# EAGLE design PCB 2d (EAGLE 9.0.1)
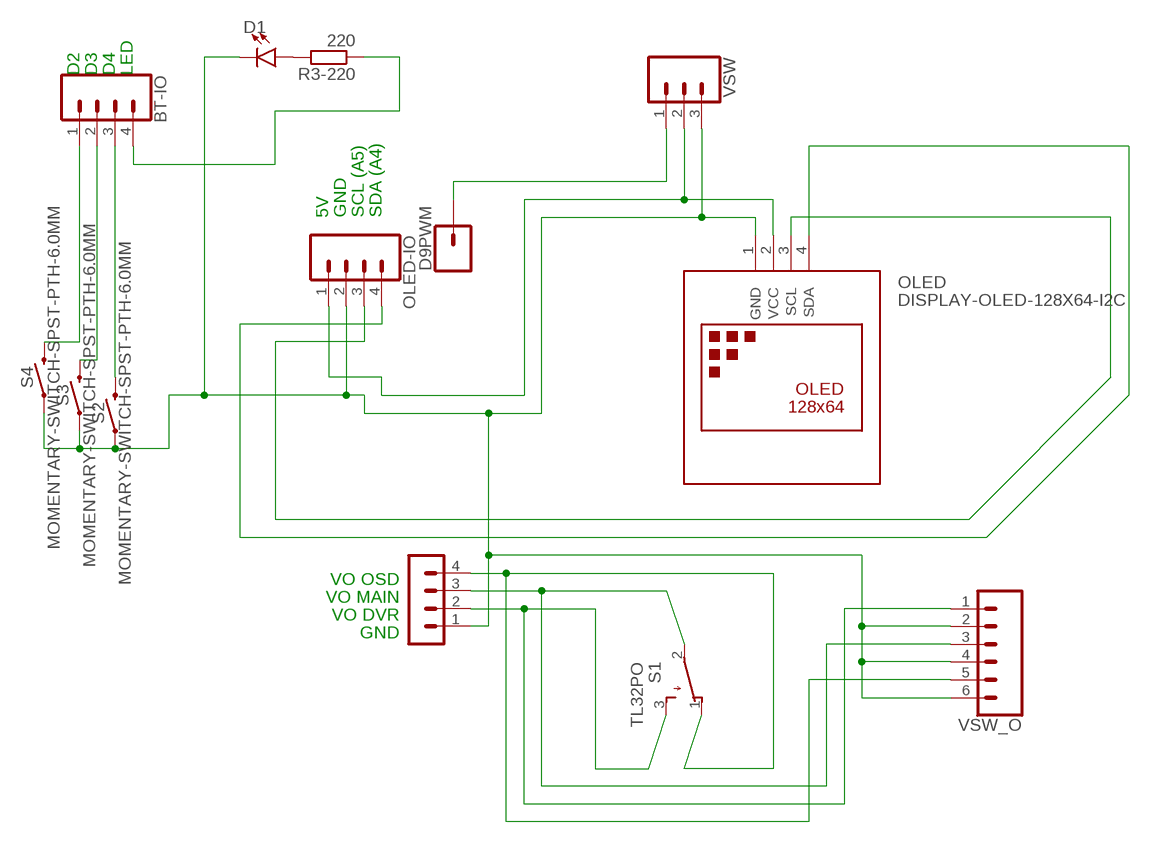
[diagram p0: schematic, sheet 1]

## Parts
BT-IO  CONN_04  [1X04]
D1  LED3MM  [LED_3MM]
D9PWM  CONN_01  [1X01]
IO3  MA04-1  [MA04-1]
OLED  DISPLAY-OLED-128X64-I2C  [DISPLAY-OLED-128X64-I2C]
OLED-IO  CONN_04  [1X04]
R3-220  220  R-EU_R1206  [R1206]
S1  TL32PO  [TL3XPO]
S2  MOMENTARY-SWITCH-SPST-PTH-6.0MM  [TACTILE_SWITCH_PTH_6.0MM]
S3  MOMENTARY-SWITCH-SPST-PTH-6.0MM  [TACTILE_SWITCH_PTH_6.0MM]
S4  MOMENTARY-SWITCH-SPST-PTH-6.0MM  [TACTILE_SWITCH_PTH_6.0MM]
VSW  CONN_03  [1X03]
VSW_O  CONN_06SILK_FEMALE_PTH  [1X06]

## Nets
GND: D1.K(C) IO3.1 OLED-IO.2 OLED.1(GND) S2.1 S3.1 S4.1 VSW.3 VSW_O.2 VSW_O.4 VSW_O.6
N$1: D1.A R3-220.2
N$2 [thin]: BT-IO.1 S4.3
N$3 [medium]: IO3.3 S1.2(P) VSW_O.3
N$4: OLED-IO.1 OLED.2(VCC) VSW.2
N$5: BT-IO.4 R3-220.1
N$6 [thin]: OLED-IO.4 OLED.4(SDA)
N$7 [thin]: OLED-IO.3 OLED.3(SCL)
N$8: D9PWM.1 VSW.1
N$10 [medium]: IO3.2 S1.3(S) VSW_O.1
N$11 [thin]: BT-IO.2 S3.3
N$12 [thin]: BT-IO.3 S2.3
VIDOUT [medium]: IO3.4 S1.1(O) VSW_O.5

## Notes on the sheet
- D2 | D3 | D4 | LED
- 5V | GND | SCL (A5) | SDA (A4)
- VO OSD
- VO MAIN
- VO DVR
- GND

## Library data of the parts
BT-IO OLED-IO = SparkFun-Connectors:CONN_04: Multi connection point. Often used as Generic Header-pin footprint for 0.1 inch spaced/style header connections On any of the 0.1 inch spaced packages, you can populate with these: Break Away Headers - Straight <https://www.sparkfun.com/products/116> (PRT-00116) Break Away Male Headers - Right Angle <https://www.sparkfun.com/products/553> (PRT-00553) Female Headers <https://www.sparkfun.com/products/115> (PRT-00115) Break Away Headers - Machine Pin <https://www.sparkfun.com/products/117> (PRT-00117) Break Away Female Headers - Swiss Machine Pin <https://www.sparkfun.com/products/743> (PRT-00743) For SCREWTERMINALS and SPRING TERMINALS visit here: Screw Terimnals on SparkFun.com <https://www.sparkfun.com/search/results?term=Screw+Terminals> (5mm/3.5mm/2.54mm spacing) This device is also useful as a general connection point to wire up your design to another part of your project. Our various solder wires solder well into these plated through hole pads. Hook-Up Wire - Assortment (Stranded, 22 AWG) <https://www.sparkfun.com/products/11375> (PRT-11375) Hook-Up Wire - Assortment (Solid Core, 22 AWG) <https://www.sparkfun.com/products/11367> (PRT-11367) View the entire wire category on our website here <https://www.sparkfun.com/categories/141> Special notes: Molex polarized connector foot print use with SKU : PRT-08231 with associated crimp pins and housings. 1MM SMD Version SKU: PRT-10208; PROD_ID: CONN-09696
D1 = SparkFun-LED:LED: LED (Generic) Standard schematic elements and footprints for 5mm, 3mm, 1206, and 0603 sized LEDs. Generic LEDs with no color specified.; PROD_ID: DIO-08794
D9PWM = SparkFun-Connectors:CONN_01: Single connection point. Often used as Generic Header-pin footprint for 0.1 inch spaced/style header connections On any of the 0.1 inch spaced packages, you can populate with these: Break Away Headers - Straight <https://www.sparkfun.com/products/116> (PRT-00116) Break Away Male Headers - Right Angle <https://www.sparkfun.com/products/553> (PRT-00553) Female Headers <https://www.sparkfun.com/products/115> (PRT-00115) Break Away Headers - Machine Pin <https://www.sparkfun.com/products/117> (PRT-00117) Break Away Female Headers - Swiss Machine Pin <https://www.sparkfun.com/products/743> (PRT-00743) This device is also useful as a general connection point to wire up your design to another part of your project. Our various solder wires solder well into these plated through hole pads. Hook-Up Wire - Assortment (Stranded, 22 AWG) <https://www.sparkfun.com/products/11375> (PRT-11375) Hook-Up Wire - Assortment (Solid Core, 22 AWG) <https://www.sparkfun.com/products/11367> (PRT-11367) View the entire wire category on our website here <https://www.sparkfun.com/categories/141> Special notes: SMTSO-256-ET is a "flush mount" nut for a 4-40 screw. We mostly use this on specialty testbeds; it is a nice way to connect hardware to your PCB at an adjustable hieght. Also note, the SNAP packages are for using a snappable style connector. We sell a baggie of snaps and they are also used on two LilyPad designs: Snap Assortment - 30 pack (male and female) <https://www.sparkfun.com/products/11347> (DEV-11347) LilyPad Arduino SimpleSnap <https://www.sparkfun.com/products/10941> (DEV-10941) LilyPad SimpleSnap Protoboard <https://www.sparkfun.com/products/10940> (DEV-10940)
IO3 = con-lstb:MA04-1: PIN HEADER; OC_FARNELL: unknown; OC_NEWARK: unknown
OLED = diy-modules:DISPLAY-OLED-128X64-I2C: 128x64 Dot Matrix OLED Module based on SSD1306 chip Variant with I2C interface More details available here: http://www.instructables.com/id/Monochrome-096-i2c-OLED-display-with-arduino-SSD13/ SSD1306 datasheet: https://cdn-shop.adafruit.com/datasheets/SSD1306.pdf Click here to find device on ebay.com <http://www.ebay.com/sch/oled+display+128x64+iic> Note: There are two variants: I2C and SPI. Search for the proper version.
R3-220 = resistor:R-EU_: RESISTOR, European symbol
S1 = switch:TL32PO: TINY SWITCH ON - MOM Source: http://www2.produktinfo.conrad.com/datenblaetter/700000-724999/705152-da-01-de-Subminiaturschalter_TL_36YO.pdf
S2-S4 = SparkFun-Switches:MOMENTARY-SWITCH-SPST: Momentary Switch (Pushbutton) - SPST Normally-open (NO) SPST momentary switches (buttons, pushbuttons). Variants PTH-12MM - 12mm square, through-hole Momentary Pushbutton Switch - 12mm Square <https://www.sparkfun.com/products/9190> (COM-09190) PTH-6.0MM, PTH-6.0MM-KIT - 6.0mm square, through-hole Mini Pushbutton Switch <https://www.sparkfun.com/products/97> (COM-00097) KIT package intended for soldering kit's - only one side of pads' copper is exposed. PTH-RIGHT-ANGLE-KIT - Right-angle, through-hole Right Angle Tactile Button <https://www.sparkfun.com/products/10791> - Used on SparkFun BigTime Watch Kit <https://www.sparkfun.com/products/11734> SMD-12MM - 12mm square, surface-mount Tactile Button - SMD (12mm) <https://www.sparkfun.com/products/12993> (COM-12993) Used on SparkFun PicoBoard <https://www.sparkfun.com/products/11888> SMD-4.5MM - 4.5mm Square Trackball Switch Used on SparkFun Blackberry Trackballer Breakout <https://www.sparkfun.com/products/13169> SMD-4.6MMX2.8MM - 4.60mm x 2.80mm, surface mount Used on SparkFun SAMD21 Mini Breakout <https://www.sparkfun.com/products/13664> SMD-5.2MM, SMD-5.2-REDUNDANT - 5.2mm square, surface-mount Mini Pushbutton Switch - SMD <https://www.sparkfun.com/products/8720> (COM-08720) Used on Arduino Pro Mini <https://www.sparkfun.com/products/11114> REDUNDANT package connects both switch circuits together SMD-6.0X3.5MM - 6.0 x 3.5mm, surface mount Momentary Reset Switch SMD <https://www.sparkfun.com/products/8229> (COM-08229) SMD-6.2MM-TALL - 6.2mm square, surface mount Tactile Button - SMD (6mm) <https://www.sparkfun.com/products/12992> Used on SparkFun Digital Sandbox <https://www.sparkfun.com/products/12651> SMD-RIGHT-ANGLE - Right-angle, surface mount Used on SparkFun Block for Intel® Edison - Arduino <https://www.sparkfun.com/products/13036>; PROD_ID: SWCH-08441; SF_SKU: COM-00097
VSW = SparkFun-Connectors:CONN_03: Multi connection point. Often used as Generic Header-pin footprint for 0.1 inch spaced/style header connections On any of the 0.1 inch spaced packages, you can populate with these: Break Away Headers - Straight <https://www.sparkfun.com/products/116> (PRT-00116) Break Away Male Headers - Right Angle <https://www.sparkfun.com/products/553> (PRT-00553) Female Headers <https://www.sparkfun.com/products/115> (PRT-00115) Break Away Headers - Machine Pin <https://www.sparkfun.com/products/117> (PRT-00117) Break Away Female Headers - Swiss Machine Pin <https://www.sparkfun.com/products/743> (PRT-00743) Stackable Header - 3 Pin (Female, 0.1") <https://www.sparkfun.com/products/13875> (PRT-13875) For SCREWTERMINALS and SPRING TERMINALS visit here: Screw Terimnals on SparkFun.com <https://www.sparkfun.com/search/results?term=Screw+Terminals> (5mm/3.5mm/2.54mm spacing) This device is also useful as a general connection point to wire up your design to another part of your project. Our various solder wires solder well into these plated through hole pads. Hook-Up Wire - Assortment (Stranded, 22 AWG) <https://www.sparkfun.com/products/11375> (PRT-11375) Hook-Up Wire - Assortment (Solid Core, 22 AWG) <https://www.sparkfun.com/products/11367> (PRT-11367) View the entire wire category on our website here <https://www.sparkfun.com/categories/141> Special notes: Molex polarized connector foot print use with SKU : PRT-08232 with associated crimp pins and housings.
VSW_O = SparkFun-Connectors:CONN_06: Multi connection point. Often used as Generic Header-pin footprint for 0.1 inch spaced/style header connections On any of the 0.1 inch spaced packages, you can populate with these: Break Away Headers - Straight <https://www.sparkfun.com/products/116> (PRT-00116) Break Away Male Headers - Right Angle <https://www.sparkfun.com/products/553> (PRT-00553) Female Headers <https://www.sparkfun.com/products/115> (PRT-00115) Break Away Headers - Machine Pin <https://www.sparkfun.com/products/117> (PRT-00117) Break Away Female Headers - Swiss Machine Pin <https://www.sparkfun.com/products/743> (PRT-00743) Arduino Stackable Header - 6 Pin <https://www.sparkfun.com/products/9280> (PRT-09280) For SCREWTERMINALS and SPRING TERMINALS visit here: Screw Terimnals on SparkFun.com <https://www.sparkfun.com/search/results?term=Screw+Terminals> (5mm/3.5mm/2.54mm spacing) This device is also useful as a general connection point to wire up your design to another part of your project. Our various solder wires solder well into these plated through hole pads. Hook-Up Wire - Assortment (Stranded, 22 AWG) <https://www.sparkfun.com/products/11375> (PRT-11375) Hook-Up Wire - Assortment (Solid Core, 22 AWG) <https://www.sparkfun.com/products/11367> (PRT-11367) View the entire wire category on our website here <https://www.sparkfun.com/categories/141>; PROD_ID: CONN-08437

## Net classes
0 default: width 0.762 mm, drill 0.508 mm, clearance 0.508 mm
1 thin: width 0.3 mm, drill 0.3 mm, clearance 0.3 mm
2 medium: width 0.4 mm, drill 0.4 mm, clearance 0.4 mm

## Board
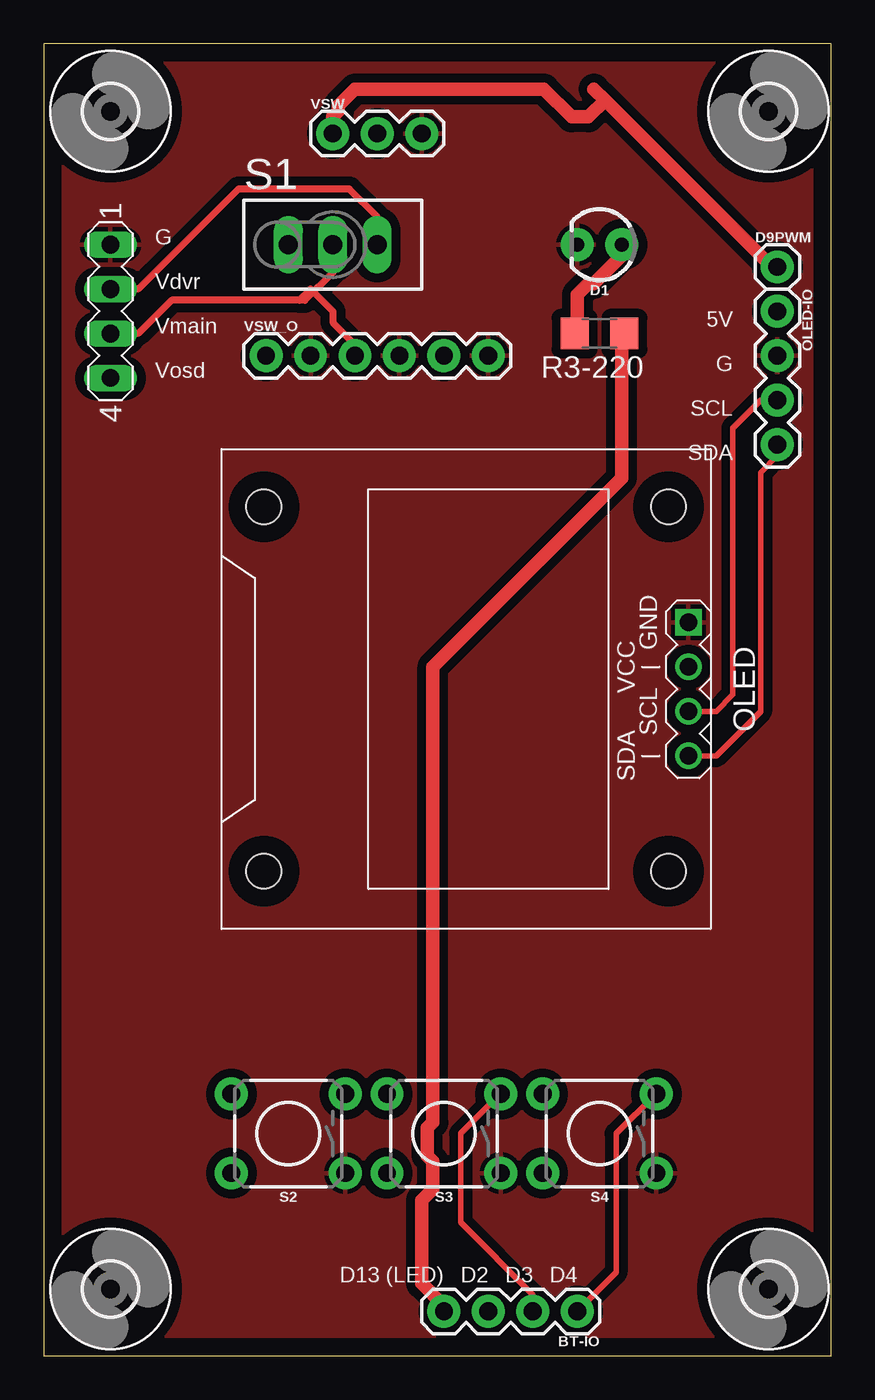
[diagram p1: board, top side]
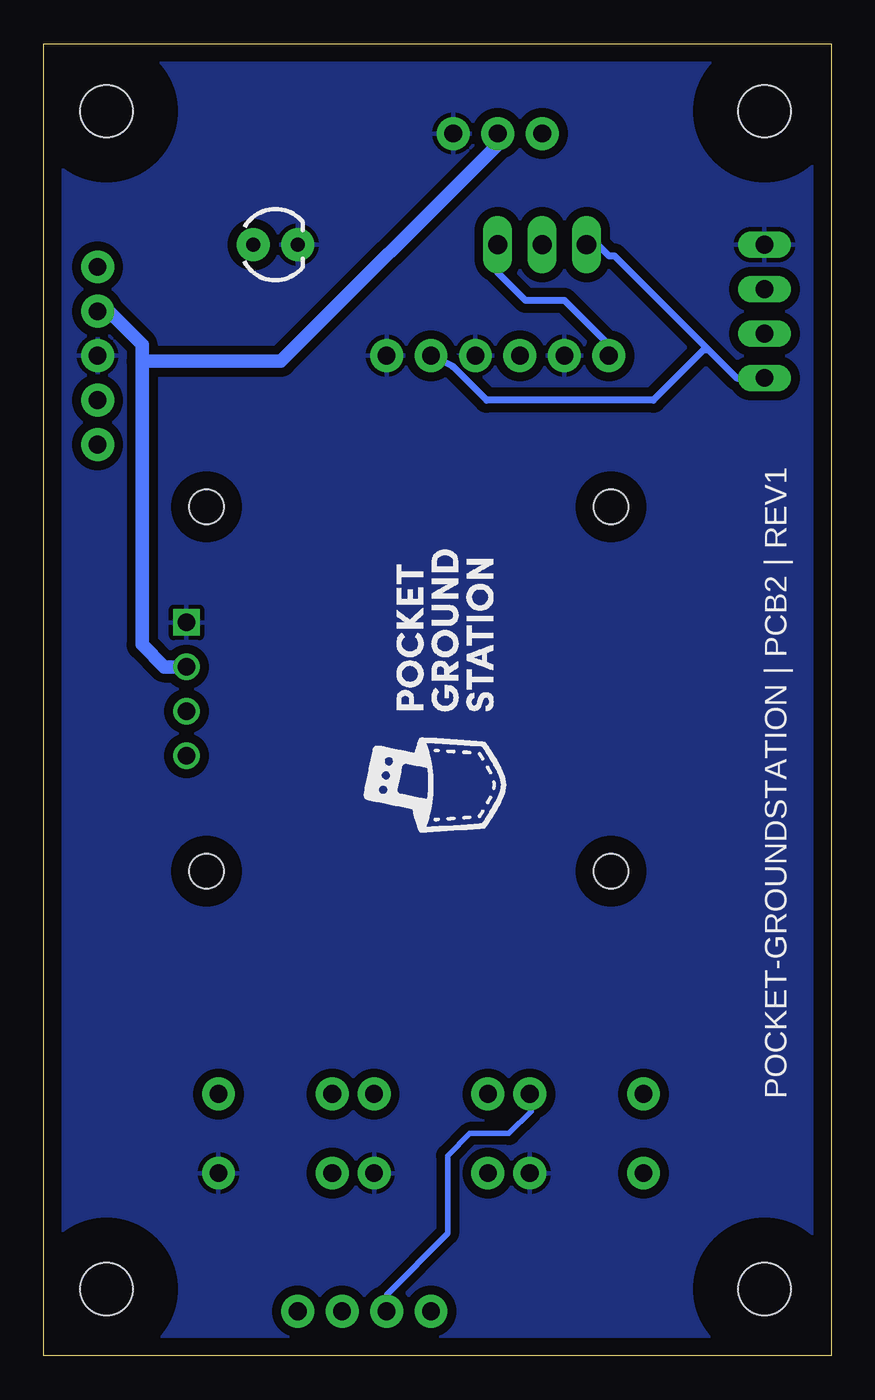
[diagram p2: board, bottom side, seen from below]

Size 44.98 x 74.98 mm. Coordinates in mm from the lower left corner, seen from the top.
Outline: 0,74.98 0,0 44.98,0 44.98,74.98 0,74.98
Copper layers (1*16): Top 0.035mm / dielectric 1.5mm / Bottom 0.035mm
Design rules "PCB Albert *": minimum track width 0.15mm, minimum drill 0.35mm, track to track 0.205mm, track to pad 0.205mm, pad to pad 0.205mm, via to via 0.205mm, smd to smd 6mil, copper to edge 40mil, drill to drill 6mil, minimum pad ring 10mil, minimum via ring 8mil, stop-mask expansion 4mil, vias tented up to drill 0mil, thermal gap 10mil

### Footprints (pad centres in the part's own frame; a part is rotated, then mirrored left to right if it is on the bottom)
1X04 = drill 1.016 pad 1.88: 1 0,0; 2 2.54,0; 3 5.08,0; 4 7.62,0
LED_3MM = drill 0.813 pad 1.88: A -1.27,0; K 1.27,0
1X01 = drill 1.016 pad 1.88: 1 0,0
MA04-1 = drill 1.016 long: 1 -3.81,0; 2 -1.27,0; 3 1.27,0; 4 3.81,0
DISPLAY-OLED-128X64-I2C = drill 1 square: 1 -3.81,12.7 | drill 1: 2 -1.27,12.7; 3 1.27,12.7; 4 3.81,12.7 | hole 2: -10.414,11.557; 10.414,11.557; 10.414,-11.557; -10.414,-11.557
R1206 = smd 1.6 x 1.803: 1 -1.422,0; 2 1.422,0
TL3XPO = drill 1.1 pad 1.422 long: 1 -2.54,0; 2 0,0; 3 2.54,0
TACTILE_SWITCH_PTH_6.0MM = drill 1.016 pad 1.88: 1 -3.251,2.261; 2 3.251,2.261; 3 -3.251,-2.261; 4 3.251,-2.261
3,0 = hole 3: 0,0
1X03 = drill 1.016 pad 1.88: 1 0,0; 2 2.54,0; 3 5.08,0
1X06 = drill 1.016 pad 1.88: 1 0,0; 2 2.54,0; 3 5.08,0; 4 7.62,0; 5 10.16,0; 6 12.7,0

### Placement (x,y rotation side)
BT-IO  30.48,2.54 180 top
D1  31.75,63.5 180 top
D9PWM  41.91,62.23 0 top
IO3  3.81,59.69 270 top
OLED  24.13,38.1 270 top
OLED-IO  41.91,59.69 270 top
R3-220  31.75,58.42 180 top
S1  16.51,63.5 0 top
S2  13.97,12.7 180 top
S3  22.86,12.7 180 top
S4  31.75,12.7 180 top
U$2  [3,0]  41.4,3.81 180 top
U$3  [3,0]  3.81,3.81 180 top
U$4  [3,0]  41.4,71.12 180 top
U$5  [3,0]  3.81,71.12 180 top
VSW  16.51,69.85 0 top
VSW_O  12.7,57.15 0 top

### Tracks (layer width: path | path; a pad name or v marks a point on that pad's centre or on a via)
GND
  pour Top: 0,74.93 0,-1.27 45.72,-1.27 45.72,76.2 0,76.2
  pour Bottom: -1.27,76.2 46.99,76.2 46.99,-2.54 -1.27,-2.54
N$1
  Top 0.762: D1.A 33.02,62.87 31.43,61.28 31.11,61.28 30.48,60.64 30.48,58.42 R3-220.2
N$2
  Top 0.3: BT-IO.1 32.7,4.76 32.7,12.7 34.92,14.92 S4.3
N$3
  Top 0.4: IO3.3 5.4,58.42 7.3,60.33 14.61,60.33 | 14.61,60.33 14.92,60.33 16.51,61.91 S1.2 | VSW_O.3 17.78,57.78 16.51,59.05 16.51,59.69 15.24,60.96 14.61,60.33
N$4
  Bottom 0.762: OLED.2 38.1,39.37 39.37,40.64 39.37,56.83 | 39.37,56.83 39.37,57.78 41.27,59.69 OLED-IO.1 | VSW.2 19.05,69.22 31.43,56.83 39.37,56.83
N$5
  Top 0.762: BT-IO.4 22.86,2.86 21.59,4.13 21.59,8.89 22.23,9.53 22.23,11.11 21.91,11.43 21.91,13.02 22.23,13.34 22.23,39.37 33.02,50.16 33.02,58.42 R3-220.1
N$6
  Top 0.3: OLED.4 38.42,34.29 40.96,36.83 40.96,50.48 41.91,51.44 OLED-IO.4
N$7
  Top 0.3: OLED.3 38.42,36.83 39.37,37.78 39.37,53.02 40.96,54.61 OLED-IO.3
N$8
  Top 0.762: 32.07,71.75 41.59,62.23 D9PWM.1 | 32.07,71.75 31.43,72.39 | VSW.1 16.51,70.8 16.83,71.12 16.83,71.44 17.78,72.39 28.57,72.39 30.16,70.8 31.11,70.8 32.07,71.75
N$10
  Top 0.4: IO3.2 5.4,60.96 11.11,66.67 17.46,66.67 19.05,65.09 S1.3
  Bottom 0.4: VSW_O.1 12.7,57.78 15.24,60.33 17.46,60.33 19.05,61.91 S1.3
N$11
  Top 0.3: BT-IO.2 27.94,3.49 23.81,7.62 23.81,12.7 26.04,14.92 S3.3
N$12
  Bottom 0.3: BT-IO.3 25.4,3.49 21.91,6.99 21.91,11.43 20.64,12.7 18.41,12.7 17.14,13.97 17.14,14.92 S2.3
VIDOUT
  Bottom 0.4: IO3.4 5.4,55.88 6.99,57.47 | 6.99,57.47 12.38,62.87 12.7,62.87 13.34,63.5 S1.1 | VSW_O.5 21.59,56.52 19.68,54.61 10.16,54.61 7.3,57.47 6.99,57.47

### Text on the board
tNames: G | Vdvr | 5V | Vmain | G | Vosd | SCL | SDA | D13 (LED) | D2 | D3 | D4
bNames: POCKET-GROUNDSTATION | PCB2 | REV1